# Altium schematic sheet top-board.SchDoc
size A; SheetNumber: 1; SheetTotal: 1
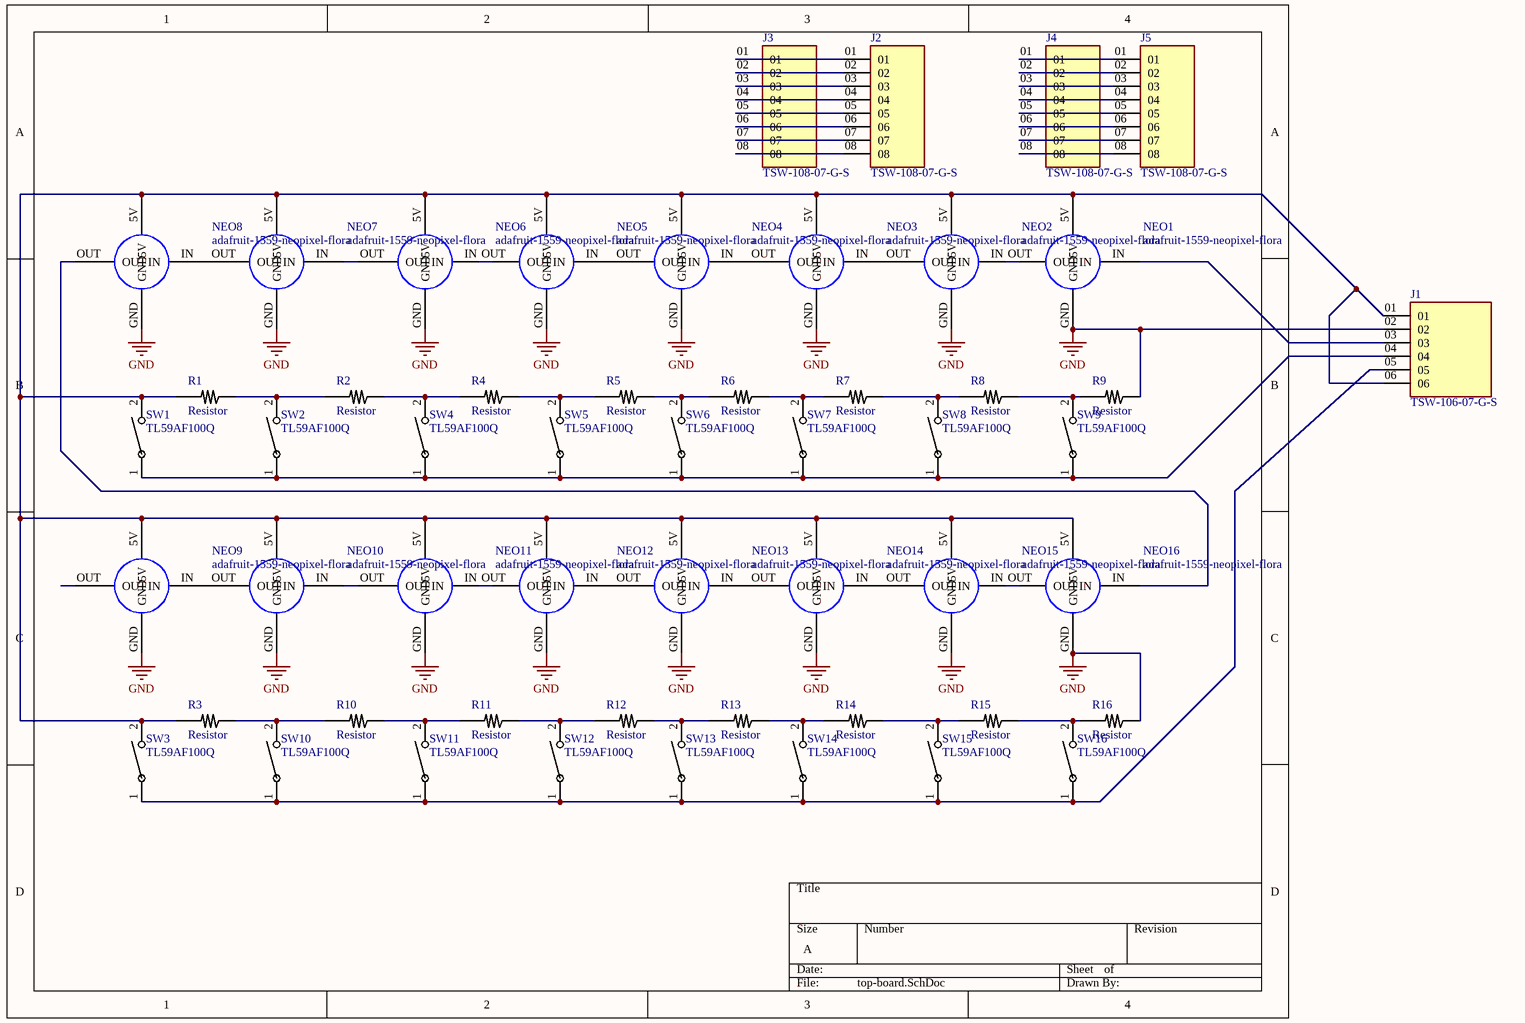
[diagram p0: top-board.SchDoc]

## Parts
J1  TSW-106-07-G-S  [SAMTEC_TSW-106-07-G-S]
J2  TSW-108-07-G-S  [SAMTEC_TSW-108-07-G-S]
J3  TSW-108-07-G-S  [SAMTEC_TSW-108-07-G-S]
J4  TSW-108-07-G-S  [SAMTEC_TSW-108-07-G-S]
J5  TSW-108-07-G-S  [SAMTEC_TSW-108-07-G-S]
NEO1  adafruit-1559-neopixel-flora  [adafruit-1559-neopixel-flora]
NEO2  adafruit-1559-neopixel-flora  [adafruit-1559-neopixel-flora]
NEO3  adafruit-1559-neopixel-flora  [adafruit-1559-neopixel-flora]
NEO4  adafruit-1559-neopixel-flora  [adafruit-1559-neopixel-flora]
NEO5  adafruit-1559-neopixel-flora  [adafruit-1559-neopixel-flora]
NEO6  adafruit-1559-neopixel-flora  [adafruit-1559-neopixel-flora]
NEO7  adafruit-1559-neopixel-flora  [adafruit-1559-neopixel-flora]
NEO8  adafruit-1559-neopixel-flora  [adafruit-1559-neopixel-flora]
NEO9  adafruit-1559-neopixel-flora  [adafruit-1559-neopixel-flora]
NEO10  adafruit-1559-neopixel-flora  [adafruit-1559-neopixel-flora]
NEO11  adafruit-1559-neopixel-flora  [adafruit-1559-neopixel-flora]
NEO12  adafruit-1559-neopixel-flora  [adafruit-1559-neopixel-flora]
NEO13  adafruit-1559-neopixel-flora  [adafruit-1559-neopixel-flora]
NEO14  adafruit-1559-neopixel-flora  [adafruit-1559-neopixel-flora]
NEO15  adafruit-1559-neopixel-flora  [adafruit-1559-neopixel-flora]
NEO16  adafruit-1559-neopixel-flora  [adafruit-1559-neopixel-flora]
R1  Resistor  [thruhole resistor]
R2  Resistor  [thruhole resistor]
R3  Resistor  [thruhole resistor]
R4  Resistor  [thruhole resistor]
R5  Resistor  [thruhole resistor]
R6  Resistor  [thruhole resistor]
R7  Resistor  [thruhole resistor]
R8  Resistor  [thruhole resistor]
R9  Resistor  [thruhole resistor]
R10  Resistor  [thruhole resistor]
R11  Resistor  [thruhole resistor]
R12  Resistor  [thruhole resistor]
R13  Resistor  [thruhole resistor]
R14  Resistor  [thruhole resistor]
R15  Resistor  [thruhole resistor]
R16  Resistor  [thruhole resistor]
SW1  TL59AF100Q  [SW_TL59AF100Q_EWI]
SW2  TL59AF100Q  [SW_TL59AF100Q_EWI]
SW3  TL59AF100Q  [SW_TL59AF100Q_EWI]
SW4  TL59AF100Q  [SW_TL59AF100Q_EWI]
SW5  TL59AF100Q  [SW_TL59AF100Q_EWI]
SW6  TL59AF100Q  [SW_TL59AF100Q_EWI]
SW7  TL59AF100Q  [SW_TL59AF100Q_EWI]
SW8  TL59AF100Q  [SW_TL59AF100Q_EWI]
SW9  TL59AF100Q  [SW_TL59AF100Q_EWI]
SW10  TL59AF100Q  [SW_TL59AF100Q_EWI]
SW11  TL59AF100Q  [SW_TL59AF100Q_EWI]
SW12  TL59AF100Q  [SW_TL59AF100Q_EWI]
SW13  TL59AF100Q  [SW_TL59AF100Q_EWI]
SW14  TL59AF100Q  [SW_TL59AF100Q_EWI]
SW15  TL59AF100Q  [SW_TL59AF100Q_EWI]
SW16  TL59AF100Q  [SW_TL59AF100Q_EWI]

## Nets
GND: J1.02 NEO1.GND NEO2.GND NEO3.GND NEO4.GND NEO5.GND NEO6.GND NEO7.GND NEO8.GND NEO9.GND NEO10.GND NEO11.GND NEO12.GND NEO13.GND NEO14.GND NEO15.GND NEO16.GND R9.1 R16.1
NetJ1_01: J1.01 J1.06 NEO1.5V NEO2.5V NEO3.5V NEO4.5V NEO5.5V NEO6.5V NEO7.5V NEO8.5V NEO9.5V NEO10.5V NEO11.5V NEO12.5V NEO13.5V NEO14.5V NEO15.5V NEO16.5V R1.2 R3.2 SW1.2 SW3.2
NetJ1_03: J1.03 NEO1.IN
NetJ1_04: J1.04 SW1.1 SW2.1 SW4.1 SW5.1 SW6.1 SW7.1 SW8.1 SW9.1
NetJ1_05: J1.05 SW3.1 SW10.1 SW11.1 SW12.1 SW13.1 SW14.1 SW15.1 SW16.1
NetJ2_01: J2.01 J3.01
NetJ2_02: J2.02 J3.02
NetJ2_03: J2.03 J3.03
NetJ2_04: J2.04 J3.04
NetJ2_05: J2.05 J3.05
NetJ2_06: J2.06 J3.06
NetJ2_07: J2.07 J3.07
NetJ2_08: J2.08 J3.08
NetJ4_01: J4.01 J5.01
NetJ4_02: J4.02 J5.02
NetJ4_03: J4.03 J5.03
NetJ4_04: J4.04 J5.04
NetJ4_05: J4.05 J5.05
NetJ4_06: J4.06 J5.06
NetJ4_07: J4.07 J5.07
NetJ4_08: J4.08 J5.08
NetNEO1_OUT: NEO1.OUT NEO2.IN
NetNEO2_OUT: NEO2.OUT NEO3.IN
NetNEO3_OUT: NEO3.OUT NEO4.IN
NetNEO4_OUT: NEO4.OUT NEO5.IN
NetNEO5_OUT: NEO5.OUT NEO6.IN
NetNEO6_OUT: NEO6.OUT NEO7.IN
NetNEO7_OUT: NEO7.OUT NEO8.IN
NetNEO8_OUT: NEO8.OUT NEO16.IN
NetNEO9_IN: NEO9.IN NEO10.OUT
NetNEO10_IN: NEO10.IN NEO11.OUT
NetNEO11_IN: NEO11.IN NEO12.OUT
NetNEO12_IN: NEO12.IN NEO13.OUT
NetNEO13_IN: NEO13.IN NEO14.OUT
NetNEO14_IN: NEO14.IN NEO15.OUT
NetNEO15_IN: NEO15.IN NEO16.OUT
NetR1_1: R1.1 R2.2 SW2.2
NetR2_1: R2.1 R4.2 SW4.2
NetR3_1: R3.1 R10.2 SW10.2
NetR4_1: R4.1 R5.2 SW5.2
NetR5_1: R5.1 R6.2 SW6.2
NetR6_1: R6.1 R7.2 SW7.2
NetR7_1: R7.1 R8.2 SW8.2
NetR8_1: R8.1 R9.2 SW9.2
NetR10_1: R10.1 R11.2 SW11.2
NetR11_1: R11.1 R12.2 SW12.2
NetR12_1: R12.1 R13.2 SW13.2
NetR13_1: R13.1 R14.2 SW14.2
NetR14_1: R14.1 R15.2 SW15.2
NetR15_1: R15.1 R16.2 SW16.2

Not connected (* = marked no-connect by the designer): NEO9 OUT

## Library data of the parts
J1 = TSW-106-07-G-S: MF: Samtec Inc.; Value: *; Availability: Unavailable; Price: None; Package: None; MP: TSW-106-07-G-S
J2-J5 = TSW-108-07-G-S: TSW - Samtec 2.54mm Pin Header 10.92mm Overall Pin Length (07) - Fast Stock; MF: Samtec Inc.; SnapEDA_Link: https://www.snapeda.com/parts/TSW-108-07-G-S/Samtec+Inc./view-part/?ref=snap; Package: None; Value: *; MP: TSW-108-07-G-S; Check_prices: https://www.snapeda.com/parts/TSW-108-07-G-S/Samtec+Inc./view-part/?ref=eda
SW1-SW16 = TL59AF100Q: No Description Available; Mfr_Name: E-Switch; Copyright: Copyright (C) 2024 Ultra Librarian. All rights reserved.; Manufacturer_Part_Number: TL59AF100Q; RefDes: RefDes; Type: DEV